# Altium schematic sheet 漏电流检测.SchDoc
size A4
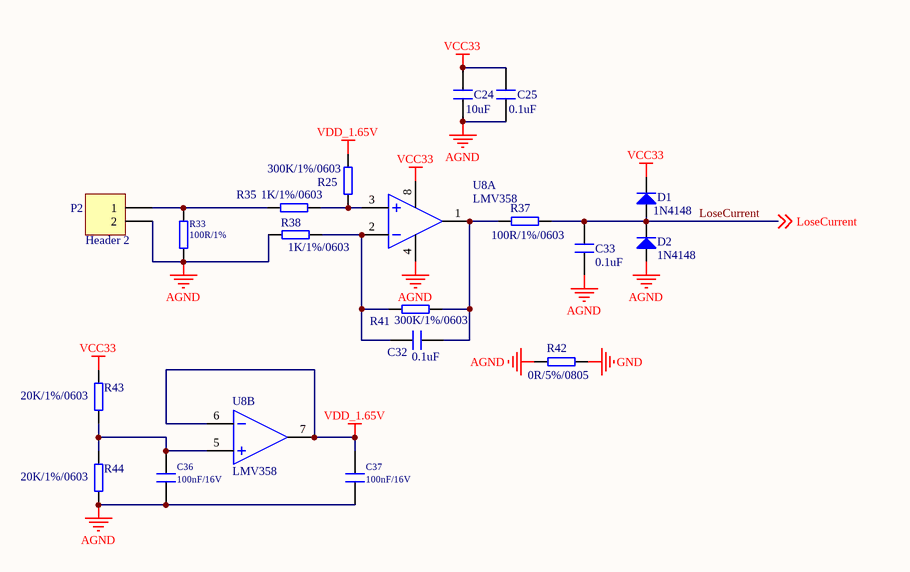
[diagram p0: 漏电流检测.SchDoc]

## Parts
C24  10uF  [0603R]
C25  0.1uF  [0603R]
C32  0.1uF  [0603R]
C33  0.1uF  [0603R]
C36  100nF/16V  [0603R]
C37  100nF/16V  [0603R]
D1  1N4148  [1206D]
D2  1N4148  [1206D]
P2  Header 2  [CONN-TH_P5.08_KF127-5.08-2P]
R25  300K/1%/0603  [0603r]
R33  100R/1%  [0805R]
R35  1K/1%/0603  [0603r]
R37  100R/1%/0603  [0603r]
R38  1K/1%/0603  [0603r]
R41  300K/1%/0603  [0603r]
R42  0R/5%/0805  [0805R]
R43  20K/1%/0603  [0603r]
R44  20K/1%/0603  [0603r]
U8  LMV358  [SO8]  (parts A,B of 2)

## Nets
AGND: C24.1 C25.1 C33.2 C36.2 C37.2 D2.2(A) P2.2 R33.1 R38.2 R42.2 R44.2 U8.4
GND: R42.1
VCC33: C24.2 C25.2 D1.1(K) R43.1 U8.8
VDD_1.65V: C37.1 R25.1 U8.6 U8.7
LoseCurrent: C33.1 D1.2(A) D2.1(K) R37.1 ; off-sheet LoseCurrent
NetC32_1: C32.1 R38.1 R41.2 U8.2
NetC32_2: C32.2 R37.2 R41.1 U8.1
NetC36_1: C36.1 R43.2 R44.1 U8.5
NetP2_1: P2.1 R33.2 R35.2
NetR25_2: R25.2 R35.1 U8.3

## Library data of the parts
C24 C25 C32 C33 C36 C37 = CAP
D1 D2 = DIODE
P2 = Header 2: Header, 2-Pin; LatestRevisionDate: 17-Jul-2002; LatestRevisionNote: Re-released for DXP Platform.; Publisher: Altium Limited
R25 R33 R35 R37 R38 R41-R44 = RES
U8 = LM358